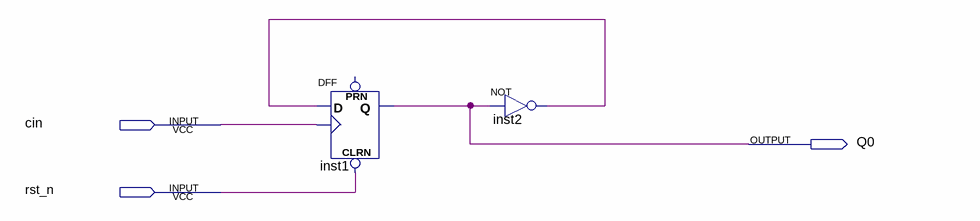
[diagram p0: schematic sheet]
// Quartus schematic stay.bdf as structural Verilog: 2 symbols, 3 pins
module stay (
  input  cin,
  input  rst_n,
  output Q0
);

  wire inst2_out;

  DFF inst1 (.CLRN(rst_n), .CLK(cin), .D(inst2_out), .Q(Q0));  // open: PRN
  not inst2 (inst2_out, Q0);
endmodule
